# Altium project Secondary_Flight_Storage_V2.PrjPcb
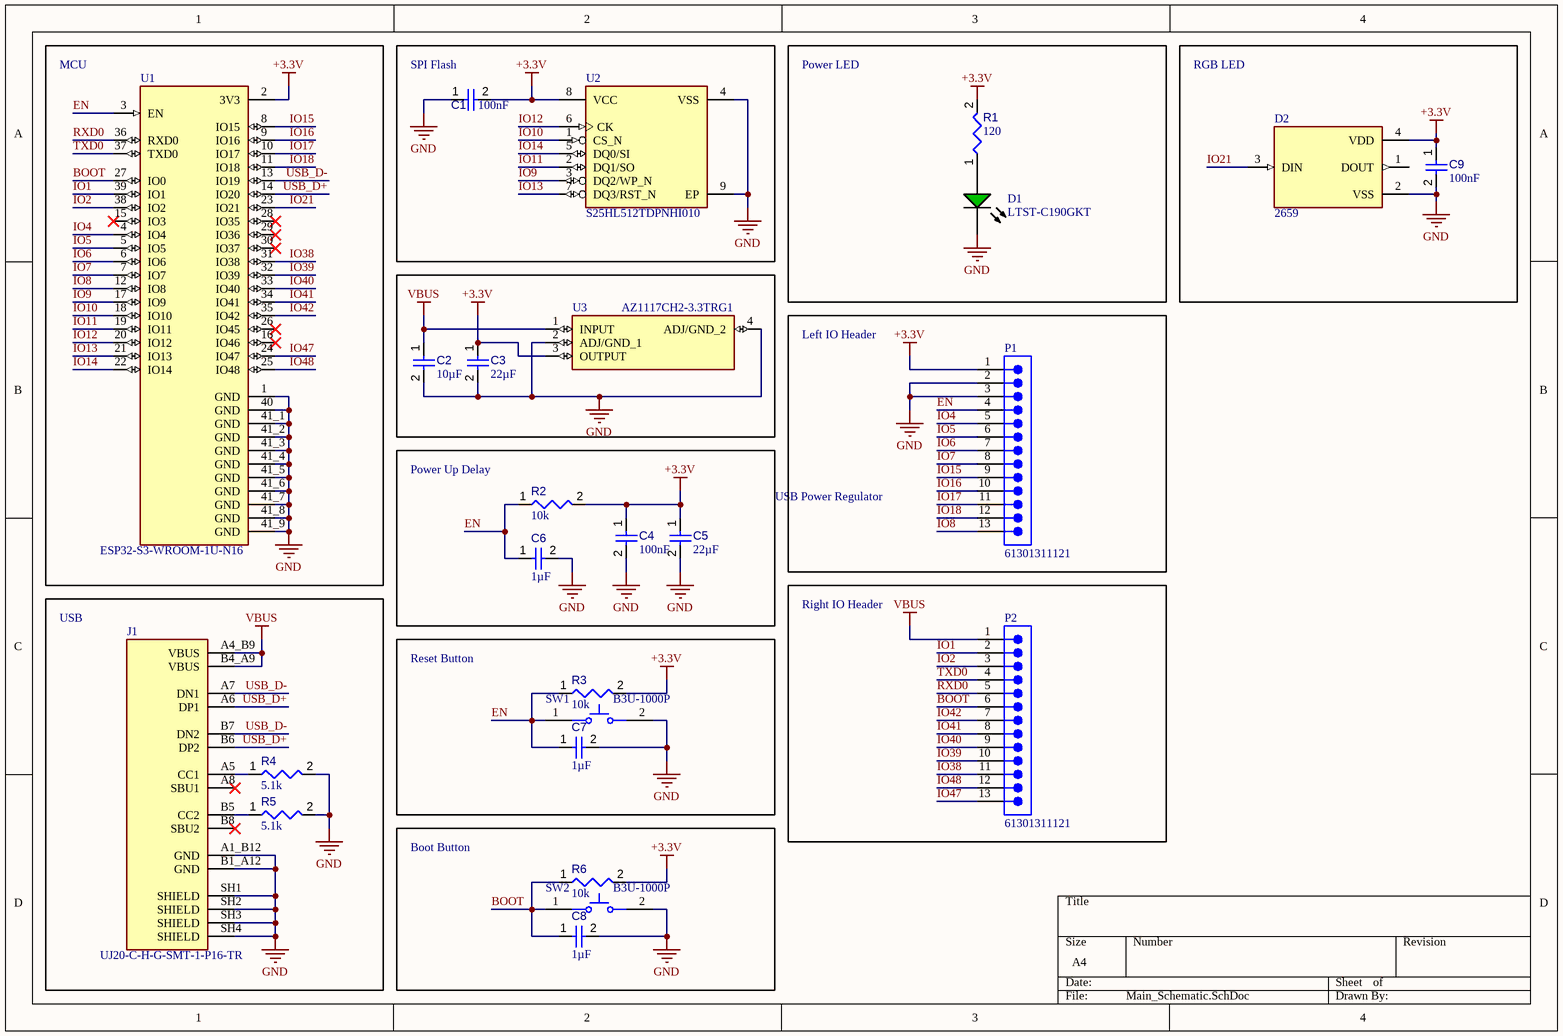
[diagram p0: Main_Schematic.SchDoc]
1 sheet, 25 parts. Net scope: global (net labels, ports and power ports of the same name join across sheets).
Board file: Main_Layout.PcbDoc

## Sheet Main_Schematic.SchDoc
size A4; SheetNumber: 1; SheetTotal: 1

### Parts
C1  value 100nF  [CAPC1608X90X40NL10T20]  (hidden comment: Capacitor 100 nF +/-10% 50 V 0603)
C2  value 10µF  [CAPC0603(1608)100_L]  (hidden comment: Capacitor 10µF +/-20% 10V 0603)
C3  value 22µF  [CAPC0603(1608)100_L]  (hidden comment: Capacitor 10µF +/-20% 10V 0603)
C4  value 100nF  [CAPC1608X90X40NL10T20]  (hidden comment: Capacitor 100 nF +/-10% 50 V 0603)
C5  value 22µF  [CAPC0603(1608)100_L]  (hidden comment: Capacitor 10µF +/-20% 10V 0603)
C6  value 1µF  [CAPC1608X94X35NL15T15]  (hidden comment: Capacitor 1 uF +/- 10% 16 V 0603)
C7  value 1µF  [CAPC1608X94X35NL15T15]  (hidden comment: Capacitor 1 uF +/- 10% 16 V 0603)
C8  value 1µF  [CAPC1608X94X35NL15T15]  (hidden comment: Capacitor 1 uF +/- 10% 16 V 0603)
C9  value 100nF  [CAPC1608X90X40NL10T20]  (hidden comment: Capacitor 100 nF +/-10% 50 V 0603)
D1  LTST-C190GKT  [LTST-C190GKT_V]
D2  2659  [2659]
J1  UJ20-C-H-G-SMT-1-P16-TR  [SAMESKY_UJ20-C-H-G-SMT-1-P16-TR]
P1  61301311121  [61301311121]
P2  61301311121  [61301311121]
R1  value 120  [RESC0603(1608)_L]  (hidden comment: Resistor 120R +/-5 % 0603 0.1 W)
R2  value 10k  [RESC1608X55X25ML10T15]  (hidden comment: Resistor 10k +/-1% 0603 100 mW)
R3  value 10k  [RESC1608X55X25ML10T15]  (hidden comment: Resistor 10k +/-1% 0603 100 mW)
R4  value 5.1k  [RESC1608X55X25ML10T15]  (hidden comment: Resistor 4k7 +/-1% 0603 100 mW)
R5  value 5.1k  [RESC1608X55X25ML10T15]  (hidden comment: Resistor 4k7 +/-1% 0603 100 mW)
R6  value 10k  [RESC1608X55X25ML10T15]  (hidden comment: Resistor 10k +/-1% 0603 100 mW)
SW1  B3U-1000P  [OMRON-B3U-1000_V]
SW2  B3U-1000P  [OMRON-B3U-1000_V]
U1  ESP32-S3-WROOM-1U-N16  [XCVR_ESP32-S3-WROOM-1U-N16]
U2  S25HL512TDPNHI010  [SON127P800X600X80-9N-V1]
U3  AZ1117CH2-3.3TRG1  [SOT230P700X180-4N]

### Blocks framed on the sheet
MCU: U1
SPI Flash: C1 U2
Power LED: D1 R1
RGB LED: C9 D2
Left IO Header: P1
Power Up Delay: C4-C6 R2
USB: J1 R4 R5
Right IO Header: P2
Reset Button: C7 R3 SW1
Boot Button: C8 R6 SW2

### Nets
+3.3V: C1.2 C3.1 C4.1 C5.1 C9.1 D2.4(VDD) P1.1 R1.2 R2.2 R3.2 R6.2 U1.2(3V3) U2.8(VCC) U3.3(OUTPUT)
GND: C1.1 C2.2 C3.2 C4.2 C5.2 C6.2 C7.2 C8.2 C9.2 D1.2(K) D2.2(VSS) J1.A1_B12(GND) J1.B1_A12(GND) J1.SH1(SHIELD) J1.SH2(SHIELD) J1.SH3(SHIELD) J1.SH4(SHIELD) P1.2 P1.3 R4.2 R5.2 SW1.2 SW2.2 U1.1(GND) U1.40(GND) U1.41_1(GND) U1.41_2(GND) U1.41_3(GND) U1.41_4(GND) U1.41_5(GND) U1.41_6(GND) U1.41_7(GND) U1.41_8(GND) U1.41_9(GND) U2.4(VSS) U2.9(EP) U3.2(ADJ/GND_1) U3.4(ADJ/GND_2)
VBUS: C2.1 J1.A4_B9(VBUS) J1.B4_A9(VBUS) P2.1 U3.1(INPUT)
BOOT: C8.1 P2.6 R6.1 SW2.1 U1.27(IO0)
EN: C6.1 C7.1 P1.4 R2.1 R3.1 SW1.1 U1.3(EN)
IO1: P2.2 U1.39(IO1)
IO2: P2.3 U1.38(IO2)
IO4: P1.5 U1.4(IO4)
IO5: P1.6 U1.5(IO5)
IO6: P1.7 U1.6(IO6)
IO7: P1.8 U1.7(IO7)
IO8: P1.13 U1.12(IO8)
IO9: U1.17(IO9) U2.3(DQ2/WP_N)
IO10: U1.18(IO10) U2.1(CS_N)
IO11: U1.19(IO11) U2.2(DQ1/SO)
IO12: U1.20(IO12) U2.6(CK)
IO13: U1.21(IO13) U2.7(DQ3/RST_N)
IO14: U1.22(IO14) U2.5(DQ0/SI)
IO15: P1.9 U1.8(IO15)
IO16: P1.10 U1.9(IO16)
IO17: P1.11 U1.10(IO17)
IO18: P1.12 U1.11(IO18)
IO21: D2.3(DIN) U1.23(IO21)
IO38: P2.11 U1.31(IO38)
IO39: P2.10 U1.32(IO39)
IO40: P2.9 U1.33(IO40)
IO41: P2.8 U1.34(IO41)
IO42: P2.7 U1.35(IO42)
IO47: P2.13 U1.24(IO47)
IO48: P2.12 U1.25(IO48)
RXD0: P2.5 U1.36(RXD0)
TXD0: P2.4 U1.37(TXD0)
USB_D+: J1.A6(DP1) J1.B6(DP2) U1.14(IO20)
USB_D-: J1.A7(DN1) J1.B7(DN2) U1.13(IO19)
NetD1_1: D1.1(A) R1.1
NetJ1_A5: J1.A5(CC1) R4.1
NetJ1_B5: J1.B5(CC2) R5.1

Not connected (* = marked no-connect by the designer): D2 1(DOUT); J1 A8(SBU1)* B8(SBU2)*; U1 15(IO3)* 16(IO46)* 26(IO45)* 28(IO35)* 29(IO36)* 30(IO37)*

### Notes on the sheet
- USB Power Regulator

### Library data of the parts
C1 C4 C9 = CMP-001-00017-6: Chip Capacitor, 100 nF, +/- 10%, 50 V, 0603 (1608 Metric); Voltage Rating: 50V; Capacitor Type: Ceramic; Tolerance: 10%; Mounting Technology: SM; Max Operating Temperature: 125°C; RoHS Compliant: True; Pins: 2; Case/Package: 0603; Min Operating Temperature: -55°C
C2 C3 C5 = CMP-001-00075-4: Chip Capacitor, 10µF +/-20%, 10V, 0603, Thickness 1 mm; Tolerance: 10%; Voltage Rating: 10V; Max Operating Temperature: 85°C; Pins: 2; Case/Package: 0603; Mounting Technology: SMT; Min Operating Temperature: -55°C
C6-C8 = CMP-001-00003-6: Chip Capacitor, 1 uF, +/- 10%, 16 V, 0603 (1608 Metric); Voltage Rating: 16V; Capacitor Type: Ceramic; Max Operating Temperature: 125°C; Pins: 2; Tolerance: 10%; Min Operating Temperature: -55°C; RoHS Compliant: True; Mounting Technology: SM; Case/Package: 0603
D1 = CMP-007-00022-2: LED Uni-Color Green, 100 mW, 30 mA, -55 to 85 degC, 2-Pin SMD, RoHS, Tape and Reel; Manufacturer: Lite-On; Power: 100mW; Forward Voltage: 2.1V; Viewing Angle: 130degrees; Forward Current: 20mA; Luminous Intensity: 6mcd; Lens Style: Clear; Manufacturer URL: http://www.us.liteon.com/; RoHS Compliant: True; Colour: Green; Package Description: 2-Pin Surface Mount Device, Body 1.6 x 0.8 mm; Datasheet URL: http://datasheet.octopart.com/LTST-C190GKT-Lite-On-datasheet-158530.pdf; Datasheet Version: Dec-06; Mounting Technology: SM; Case/Package: 0603; Package Reference: C190GKT; Packaging: TapeandReel; Min Operating Temperature: -55°C; Nominal Vf: 2.1V; Package Quantity: 3000; Illumination Colour: Green; Max Operating Temperature: 85°C; Pins: 2
D2 = 2659: 20 AWG Hook-Up Wire 26/34 White 300V 40.00' _12.19m_; MF: Adafruit Industries; MP: 2659; SnapEDA_Link: https://www.snapeda.com/parts/2659/Adafruit%20Industries%20LLC/view-part/548522/?ref=snap; Package: TQFP-32 Adafruit Industries; Digi-Key_Purchase_URL: https://www.digikey.com/product-detail/en/pololu-corporation/2659/2183-2659-ND/10451102?utm_source=snapeda&utm_medium=aggregator&utm_campaign=symbol; Digi-Key_Part_Number: 2183-2659-ND; Value: *
J1 = CMP-002-00071-1: USB-C (USB TYPE-C) USB 2.0 Receptacle Connector 24 (16+8 Dummy) Position Surface Mount, Right Angle; Through Hole; MF: Same Sky; Pins: 16; MP: UJ20-C-H-G-SMT-1-P16-TR; Value: *; Design Item ID: UJ20-C-H-G-SMT-1-P16-TR; Component Type: Standard; Case/Package: None; Check_prices: https://au.mouser.com/ProductDetail/Same-Sky/UJ20-C-H-G-SMT-1-P16-TR?qs=IKkN%2F947nfA6nby92vSKkw%3D%3D; SnapEDA_Link: https://www.snapeda.com/parts/UJ20-C-H-G-SMT-1-P16-TR/Same+Sky/view-part/?ref=snap; Source: UJ20-C-H-G-SMT-1-P16-TR.SchLib
P1 P2 = CMP-002-00072-1: Header, 2.54 Mm, Pin Header, 13 Pins, Single Row, 3A, Wr-phd Series; Gender: Male; Connector Type: Male Pin; Max Operating Temperature: 105°C; Pins: 13; Min Operating Temperature: -40°C; Mounting Technology: Through Hole
R1 = CMP-009-00176-3: Chip Resistor, 120 Ohms, +/-5 %, 0.1 W, -55 to 155 degC, 0603; Power: 100mW; Tolerance: 5%; Max Operating Temperature: 155°C; Pins: 2; Case/Package: 0603; Min Operating Temperature: -55°C
R2 R3 R6 = CMP-009-00017-5: Chip Resistor, 10 KOhm, +/- 1%, 01 W, -55 to 155 degC, 0603 (1608 Metric); Voltage Rating: 50V; Power: 100mW; RoHS Compliant: True; Min Operating Temperature: -55°C; Pins: 2; Case/Package: 0603; Mounting Technology: SM; Max Operating Temperature: 155°C; Tolerance: 1%
R4 R5 = CMP-009-00031-5: Chip Resistor, 4.7 KOhm, +/- 1%, 0.1 W, -55 to 155 degC, 0603 (1608 Metric); Power: 100mW; Tolerance: 1%; Mounting Technology: SM; Case/Package: 0603; RoHS Compliant: True; Pins: 2; Min Operating Temperature: -55°C; Max Operating Temperature: 155°C
SW1 SW2 = CMP-011-00000-2: Tactile Switch, SPST-NO, 0.05 A, 12 V, -25 to 70 degC, 2-Pin SMD, RoHS, Tape and Reel; Manufacturer: Omron Electronic Components; IP Rating: IP40; Current Rating: 50mA; Max Contact Resistance: 100mohm; Operating Force: 153gf; Throw Configuration: SPST; Resistance: 0.1Ohm; Max Voltage Rating (DC): 12V; Contact Material: Silver; Max Current Rating: 50mA; Datasheet URL: http://www.omron.com/ecb/products/pdf/en-b3u.pdf; Mounting Technology: SM; Case/Package: B3U-1000; Packaging: TapeandReel; Package Reference: B3U-1000; Manufacturer URL: http://www.omron.com/; Datasheet Version: Jan-15; RoHS Compliant: True; Max Operating Temperature: 70°C; Contact Current Rating: 50mA; Package Quantity: 3500; Package Description: 2-Pin Surface Mount Device, Body 3 x 2.5 mm; Voltage Rating (DC): 12V; Min Operating Temperature: -25°C; Voltage Rating: 12V
U1 = CMP-006-000000-1: Bluetooth, WiFi 802.11b/g/n, Bluetooth v5.0 Transceiver Module 2.4GHz Antenna Not Included, U.FL Surface Mount; MF: Espressif Systems; Value: *; Pin Count: 49; MP: ESP32-S3-WROOM-1U-N16; Package: None; SnapEDA_Link: https://www.snapeda.com/parts/ESP32-S3-WROOM-1U-N16/Espressif+Systems/view-part/?ref=snap; Source: ESP32-S3-WROOM-1U-N16.SchLib; Design Item ID: ESP32-S3-WROOM-1U-N16; Component Type: Standard; Check_prices: https://au.mouser.com/ProductDetail/Espressif-Systems/ESP32-S3-WROOM-1U-N16?qs=Li%252BoUPsLEntAI1ynUyotnA%3D%3D
U2 = CMP-031-00008-2: 512 Mb, SEMPER Flash Quad SPI; Manufacturer: Infineon Technologies; Pins: 9; Design Item ID: S25HL512TDPNHI010; Component Type: Standard; Case/Package: PG-WSON-8-805; Source: S25HL512TDPNHI010.SchLib; Manufacturer Order Number: S25HL512TDPNHI010
U3 = AZ1117CH2-3.3TRG1: Linear Voltage Regulator IC Positive Fixed 1 Output 1A SOT-223-3; MF: Diodes Inc.; Package: SOT-223 Diodes Inc.; Price: None; Check_prices: https://www.snapeda.com/parts/AZ1117CH2-3.3TRG1/Diodes+Inc./view-part/?ref=eda; Value: *; SnapEDA_Link: https://www.snapeda.com/parts/AZ1117CH2-3.3TRG1/Diodes+Inc./view-part/?ref=snap; MP: AZ1117CH2-3.3TRG1; Availability: In Stock; Purchase-URL: https://pricing.snapeda.com/search?q=AZ1117CH2-3.3TRG1&ref=eda